# Altium schematic sheet KEY_PCB.SchDoc
size A4; SheetNumber: 3; SheetTotal: 3
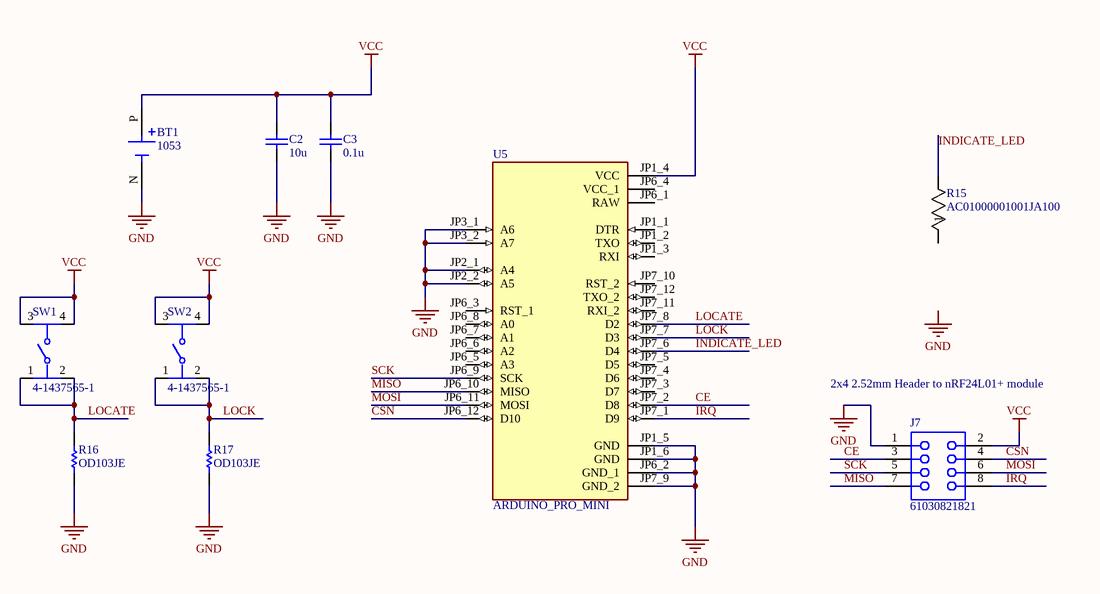
[diagram p0: KEY_PCB.SchDoc]

## Parts
BT1  1053  [BAT_1053]
C2  value 10u  (hidden comment: Capacitor)
C3  value 0.1u  (hidden comment: Capacitor)
J7  61030821821  [61030821821]
R15  AC01000001001JA100  [RES_AC01_VIS]
R16  OD103JE  [OMTE-RES7X2.5-2]
R17  OD103JE  [OMTE-RES7X2.5-2]
SW1  4-1437565-1  [FP-4-1437565-1-MFG]
SW2  4-1437565-1  [FP-4-1437565-1-MFG]
U5  ARDUINO_PRO_MINI  [MODULE_ARDUINO_PRO_MINI]

## Nets
GND: BT1.N(NEG) C2.1 C3.1 J7.1 R16.1 R17.1 U5.JP1_5(GND) U5.JP1_6(GND) U5.JP2_1(A4) U5.JP2_2(A5) U5.JP3_1(A6) U5.JP3_2(A7) U5.JP6_2(GND_1) U5.JP7_9(GND_2)
VCC: BT1.P(POS) C2.2 C3.2 J7.2 SW1.3 SW1.4 SW2.3 SW2.4 U5.JP1_4(VCC)
CE: J7.3 U5.JP7_2(D8)
CSN: J7.4 U5.JP6_12(D10)
INDICATE_LED: R15.2 U5.JP7_6(D4)
IRQ: J7.8 U5.JP7_1(D9)
LOCATE: R16.2 SW1.1 SW1.2 U5.JP7_8(D2)
LOCK: R17.2 SW2.1 SW2.2 U5.JP7_7(D3)
MISO: J7.7 U5.JP6_10(MISO)
MOSI: J7.6 U5.JP6_11(MOSI)
SCK: J7.5 U5.JP6_9(SCK)

Not connected (* = marked no-connect by the designer): R15 1; U5 JP1_1(DTR) JP1_2(TXO) JP1_3(RXI) JP6_1(RAW) JP6_3(RST_1) JP6_4(VCC_1) JP6_5(A3) JP6_6(A2) JP6_7(A1) JP6_8(A0) JP7_3(D7) JP7_4(D6) JP7_5(D5) JP7_10(RST_2) JP7_11(RXI_2) JP7_12(TXO_2)

## Notes on the sheet
- 2x4 2.52mm Header to nRF24L01+ module
- Labels drawn without touching a wire or pin: GND

## Library data of the parts
BT1 = 1053: Battery Holder, Auto-In/EZ-Out, THM, Coin Cell, 24mm, Plastic, UL94V-0, Black | Keystone Electronics 1053; SnapEDA_Link: https://www.snapeda.com/parts/1053/Keystone/view-part/?ref=snap; Package: Package; Value: *; MF: Keystone Electronics; MP: 1053; Check_prices: https://www.snapeda.com/parts/1053/Keystone/view-part/?ref=eda
C2 C3 = Capacitor: SimulationGenericComponent: True
J7 = CMP-1502-01304-3: NexarPartId: 89205501; Gender: Female; Current Rating: 3A; Operating Supply Voltage: 250V; Contact Resistance: 20mΩ; Orientation: Vertical; RoHS: Non-Compliant; Number of Pins: 8; Packaging: Tape and Reel; Lead Pitch: 2.54mm
R15 = CMP-T1-00030-42521882-4: VISHAY AC01000001001JA100 Through Hole Resistor, 1 kohm, Axial Leaded, 1 W, 5%, AC Series; Lead Diameter: 800µm; Power Rating: 1W; Temperature Coefficient: 180ppm/°C; Voltage Rating (DC): 32V; Resistance: 1kΩ; Lead Free: Lead Free; Features: Flame Retardant Coating; RoHS: Compliant; Radiation Hardening: No; Packaging: Tape & Box (TB); Length: 11mm; Min Operating Temperature: -40°C; Military Standard: Not; Case/Package: Axial; Number of Pins: 2; Diameter: 4.3mm; Tolerance: 5%; Contact Plating: Tin; NexarPartId: 42521882; Number of Terminations: 2; REACH SVHC: Unknown; Termination: Axial; Composition: Wirewound; Max Power Dissipation: 1W; Max Operating Temperature: 275°C; Schedule B: 8533210080, 8533210080
R16 R17 = CMP-2000-06865-1: Little Demon(R) Carbon Composition Molded OD Series, 250 V, 10 KOhm, +/-5%, -70 to 130 degC, 2-Pin THD, RoHS, Bulk; Manufacturer: Ohmite; Resistance (Ohms): 10k; Power Rating: 0.25W; Power (Watts): 0.25W,1/4W; Tolerance: ±5%; Online Catalog: OD,OF,OASeries,LittleDemon®; Catalog Drawings: OD,OF,OASeries; EDA / CAD Models: DownloadfromAcceleratedDesigns; Mounting Technology: ThroughHole; Datasheet Version: 06/2016; RoHS Information: LittleDemon"E"SeriesMaterialDeclaration; Number of Terminations: 2; Temperature Coefficient: -; Height: -; Composition: CarbonComposition; Package Description: 2-Pin THD Resistor, Body 7 x 2.5 mm, Lead Dia. 0.6 mm; Size / Dimension: 0.098"Diax0.276"L(2.50mmx7.00mm); Category: Resistors; Manufacturer URL: http://www.ohmite.com/; Features: PulseWithstanding; Family: ThroughHoleResistors; PartNumber: OD103JE; Supplier Device Package: Axial; Package / Case: Axial; Standard Package: 100; Package Reference: RES7X2.5; Operating Temperature: -; Series: LittleDemon®OD; Datasheet URL: http://www.ohmite.com/cat/res_od_of_oa.pdf; Packaging: Bulk
SW1 SW2 = CMP-03407-000003-1: SWITCH TACTILE SPST-NO 0.05A 24V; Manufacturer: TE Connectivity; Ciiva Ids: 2672442; Contact Current Rating: 50mA; Operating Force: 160gf; Contact Resistance: 100mΩ; Electromechanical Life: 100000Cycles; Standoff Height: 0.05mm; Import Ts: 1521848451; Category: Switch; ComponentLink2Description: Datasheet; Mount: Surface Mount; Digikey Description: SWITCH TACTILE SPST-NO 0.05A 24V; Device Class L3: Tactile Switches; Release Date: 1503379960; Octopart: https://octopart.com/fsm4jsma-te+connectivity-55488004; Temperature Range Low: -35°C; Lead Free: Yes; RoHS: TRUE; Mouser Description: Switch Tactile OFF (ON) SPST Round Button Gull Wing 0.05A 12VDC 1.57N SMD Loose Piece; Voltage Rating Dc: 24V; ComponentLink2URL: https://www.te.com/commerce/DocumentDelivery/DDEController?Action=showdoc&DocId=Customer+Drawing%7F2-1437565-7%7FV%7Fpdf%7FEnglish%7FENG_CD_2-1437565-7_V.pdf%7F4-1437565-1; Height: 5.38mm; Package: 0; Temperature Range High: +85°C; Device Class L2: Switches; Manufacturer Part Number: 4-1437565-1; Temperature: -35°C to +85°C; Device Class L1: Electromechanical; Automotive: No; Throw Configuration: SPST-NO
U5 = ARDUINO_PRO_MINI: This board was developed for applications and installations where space is premium and projects are made as permanent set ups. Small, available in 3.3 V and 5 V versions, powered by ATmega328P.; MP: Arduino Pro Mini; SnapEDA_Link: https://www.snapeda.com/parts/Arduino%20Pro%20Mini/Arduino/view-part/?ref=snap; Package: None; Value: *; MF: Arduino; Check_prices: https://www.snapeda.com/parts/Arduino%20Pro%20Mini/Arduino/view-part/?ref=eda